# Altium schematic sheet Audio Codec.SchDoc
size Letter
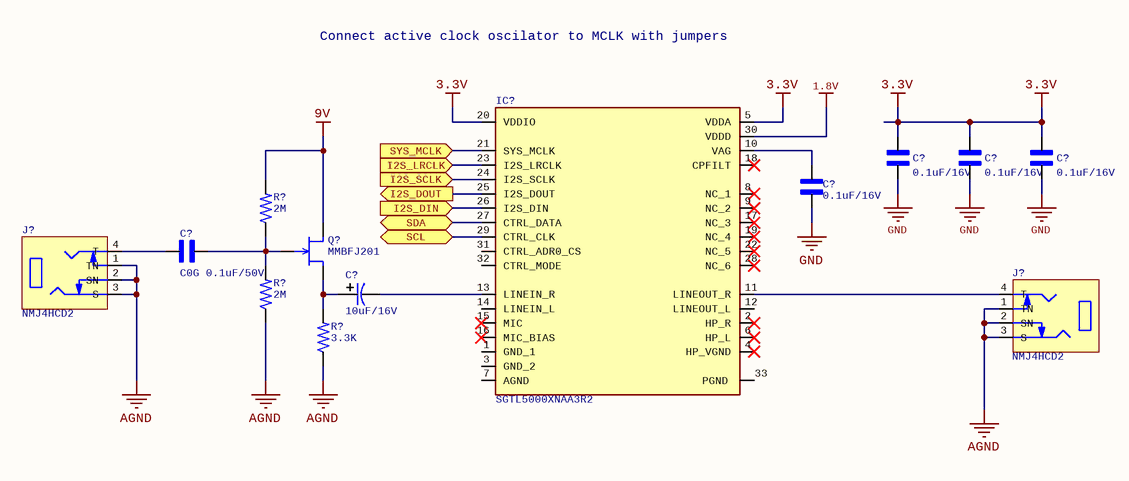
[diagram p0: Audio Codec.SchDoc]

## Parts
(Parts that share a designator on the sheet are numbered #1, #2 ... from top to bottom, then left to right.)
C?#1  0.1uF/16V  [C0603]
C?#2  0.1uF/16V  [C0603]
C?#3  0.1uF/16V  [C0603]
C?#4  0.1uF/16V  [C0603]
C?#5  C0G 0.1uF/50V  [C0603]
C?#6  10uF/16V  [C_POL_5X11_PTH]
IC?  SGTL5000XNAA3R2  [QFN32]
J?#1  NMJ4HCD2  [NMJ4HCD2]
J?#2  NMJ4HCD2  [NMJ4HCD2]
Q?  MMBFJ201  [SOT-23-3]
R?#1  2M  [R0603]
R?#2  2M  [R0603]
R?#3  3.3K  [R0603]

## Ports
I2S_DIN (in), I2S_DOUT (out), I2S_LRCLK (in), I2S_SCLK (in), SCL (bidir), SDA (bidir), SYS_MCLK (in)

## Nets
1.8V: IC?.30(VDDD)
3.3V: C?#1.1 C?#2.1 C?#3.1 IC?.5(VDDA) IC?.20(VDDIO)
9V: Q?.1(D) R?#1.2
AGND: J?#1.1(TN) J?#1.2(SN) J?#1.3(S) J?#2.1(TN) J?#2.2(SN) J?#2.3(S) R?#2.1 R?#3.1
GND: C?#1.2 C?#2.2 C?#3.2 C?#4.1
I2S_DIN: IC?.26(I2S_DIN) ; port I2S_DIN
I2S_DOUT: IC?.25(I2S_DOUT) ; port I2S_DOUT
I2S_LRCLK: IC?.23(I2S_LRCLK) ; port I2S_LRCLK
I2S_SCLK: IC?.24(I2S_SCLK) ; port I2S_SCLK
SCL: IC?.29(CTRL_CLK) ; port SCL
SDA: IC?.27(CTRL_DATA) ; port SDA
SYS_MCLK: IC?.21(SYS_MCLK) ; port SYS_MCLK
NetC?#4_2: C?#4.2 IC?.10(VAG)
NetC?#5_1: C?#5.1 J?#1.4(T)
NetC?#5_2: C?#5.2 Q?.3(G) R?#1.1 R?#2.2
NetC?#6_1: C?#6.1 Q?.2(S) R?#3.2
NetC?#6_2: C?#6.2 IC?.13(LINEIN_R)
NetIC?_11: IC?.11(LINEOUT_R) J?#2.4(T)

Not connected (* = marked no-connect by the designer): IC? 1(GND_1) 2(HP_R)* 3(GND_2) 4(HP_VGND)* 6(HP_L)* 7(AGND) 8(NC_1)* 9(NC_2)* 12(LINEOUT_L) 14(LINEIN_L) 15(MIC)* 16(MIC_BIAS)* 17(NC_3)* 18(CPFILT)* 19(NC_4)* 22(NC_5)* 28(NC_6)* 31(CTRL_ADR0_CS) 32(CTRL_MODE) 33(PGND)

## Notes on the sheet
- Connect active clock oscilator to MCLK with jumpers

## Library data of the parts
C?#1-C?#4 = C0603 0.1uF/16V: MLCC 0.1UF, 16V, X5R, 10%, 0603.; Manufacturer: Kyocera AVX; Manufacturer Part Number: 0603YD104KAT2A; Capacitance: 100nF; Supplier 1: Mouser; Supplier Part Number 1: 581-0603YD104KAT2A; RoHS: Yes; Category: Ceramic Capacitors; Stock 1: 3315; Pricing 1: 1=0.26000, 10=0.11400, 50=0.11400, 100=0.09700, 1000=0.05900, 10000=0.04800 (USD); Mount: Surface Mount; Case/Package: 0603; Number of Pins: 2; Case Code (Imperial): 0603; Case Code (Metric): 1608; Min Operating Temperature: -55°C; Max Operating Temperature: 85°C; Package Quantity: 4000; Voltage Rating: 16V; Voltage Rating (DC): 16V; Tolerance: 10%; Packaging: Tape and Reel; Dielectric: X5R; Termination: SMD/SMT; Length: 1.6mm; Width: 0.81mm; Height: 0.9mm; Thickness: 0.035inch; Depth: 0.81mm; Lead Free: Lead Free; ComponentLink1URL: https://datasheet.ciiva.com/11504/cx5r-11504040.pdf?src-supplier=Avnet; ComponentLink1Description: https://datasheet.ciiva.com/11504/cx5r-11504040.pdf?src-supplier=Avnet; ComponentLink2URL: https://datasheet.ciiva.com/208/cx5r-208121.pdf?src-supplier=Digi-Key; ComponentLink2Description: https://datasheet.ciiva.com/208/cx5r-208121.pdf?src-supplier=Digi-Key
C?#5 = C0603 0.1uF/50V: MLCC 0.1uF 50V C0G 10% 0603; Manufacturer: TDK; Manufacturer Part Number: C1608X5R1H104K080AA; Dielectric Material: Ceramic; Capacitance: 100nF; Dielectric: X5R; Supplier 1: Mouser; Supplier Part Number 1: 810-C1608X5R1H104K; RoHS: Yes; Category: Ceramic Capacitors; Stock 1: 520600; Pricing 1: 1=0.12000, 10=0.04500, 100=0.03700, 500=0.02600, 1000=0.02100, 4000=0.01800 (USD); Mount: Surface Mount; Case/Package: 0603; Number of Pins: 2; Case Code (Metric): 1608; Case Code (Imperial): 0603; Weight: 7.1E-05oz; Min Operating Temperature: -55°C; Max Operating Temperature: 85°C; Tolerance: 10%; Voltage Rating: 50V; Packaging: Tape and Reel; Voltage Rating (DC): 50V; Termination: SMD/SMT; Package Quantity: 1; Resistor Type: Ceramic; Length: 1.6mm; Width: 0.031inch; Height: 0.8mm; Depth: 0.8mm; Thickness: 0.035inch; Radiation Hardening: No; REACH SVHC: No SVHC; Lead Free: Lead Free; Supplier 2: Mouser; Supplier Part Number 2: 187-CL10B104KB8NNNC
C?#6 = CPOL 100uF/10V: Aluminum Electrolytic Capacitors - Radial Leaded 16V 10uF 5x11mm; Manufacturer: Wurth Elektronik; Manufacturer Part Number: 860010272005; Supplier 1: Mouser; Supplier Part Number 1: 710-860010272005; RoHS: Yes; Category: Capacitors; Stock 1: 5937; Pricing 1: 1=0.19000, 10=0.13600, 50=0.08200, 100=0.06900, 1000=0.04200, 10000=0.03500 (USD); Mount: Through Hole; Case/Package: Radial
IC? = SGTL5000XNAA3R2: Integrated Circuit; Manufacturer_Name: NXP; Datasheet Link: http://www.nxp.com/docs/en/data-sheet/SGTL5000.pdf; Height: 0.9mm; Manufacturer_Part_Number: SGTL5000XNAA3R2; Mouser Part Number: 841-SGTL5000XNAA3R2; Mouser Price/Stock: https://www.mouser.co.uk/ProductDetail/NXP-Semiconductors/SGTL5000XNAA3R2?qs=g5o6z0NmdpTo1sUyP1uGYA%3D%3D; Arrow Part Number: SGTL5000XNAA3R2; Arrow Price/Stock: https://www.arrow.com/en/products/sgtl5000xnaa3r2/nxp-semiconductors
J?#1 J?#2 = TS Audio Jack 6.3mm: Phone Connectors 2C MONO 2-SPST NC; Manufacturer: Neutrik; Number of Terminals/Pins: 4; Max Current Rating: 3A; Gender: Female; Voltage Rating: 50V; Number of Ports: 1; Number of Contacts: 2; Supplier 1: Mouser; Supplier Part Number 1: 550-12202; Manufacturer Part Number: NMJ4HCD2; RoHS: Yes; Category: Audio / Video Connectors; Stock 1: 39770; Pricing 1: 1=1,51000, 10=1,39000, 50=1,36000, 100=1,18000, 1000=1,11000, 10000=1,10000 (USD); Mount: Through Hole; Number of Pins: 4; Contact Plating: Silver; Color: Black; Contact Material: Brass; Weight: 0.246918oz; Housing Material: Polyamide; Min Operating Temperature: -25°C; Max Operating Temperature: 70°C; Package Quantity: 200; Termination: Through Hole; Orientation: Horizontal; Series: M; RoHS Compliant: Yes; ComponentLink1URL: https://datasheet.ciiva.com/16148/210-199761-16148179.pdf?src-supplier=Onlinecomponents.com; ComponentLink1Description: https://datasheet.ciiva.com/16148/210-199761-16148179.pdf?src-supplier=Onlinecomponents.com
Q? = JFET MMBFJ201: JFET N-Channel Transistor General Purpose; Manufacturer: ON Semiconductor / Fairchild; Power Dissipation: 350mW; Element Configuration: Single; Voltage Rating (DC): 40V; Current Rating: 50mA; Gate to Source Voltage (Vgs): -40V; Continuous Drain Current (ID): 1mA; Supplier 1: Mouser; Supplier Part Number 1: 512-MMBFJ201; Manufacturer Part Number: MMBFJ201; RoHS: Yes; Category: JFETs; Stock 1: 131519; Pricing 1: 1=0,42000, 10=0,31400, 50=0,31400, 100=0,23400, 1000=0,13200, 10000=0,12200 (USD); Case/Package: SOT-23; Number of Pins: 3; Min Operating Temperature: -55°C; Max Operating Temperature: 150°C; Packaging: Tape and Reel; Polarity: N-CHANNEL; Max Power Dissipation: 350mW; Package Quantity: 1; Length: 2.92mm; Width: 1.3mm; Height: 0.93mm; Radiation Hardening: No; REACH SVHC: No SVHC; Lead Free: Lead Free; Mount: Surface Mount; Weight: 0.03g; Drain to Source Voltage (Vdss): 40V; Series: MMBFJ201; Breakdown Voltage: -40V; RoHS Compliant: Yes
R?#1 R?#2 = R0603 1M: RES SMD 2M OHM 1% 1/10W 0603; Manufacturer: Yageo; Manufacturer Part Number: RC0603FR-071ML; Voltage Rating: 75V; Voltage Rating (DC): 50V; Resistance: 1MR; Power Rating: 100mW; Temperature Coefficient: 100ppm/°C; Application(s): HIGH RELIABILITY; Supplier 1: Mouser; Supplier Part Number 1: 603-RC0603FR-071ML; RoHS: Yes; Category: Chip SMD Resistors; Stock 1: 1321822; Pricing 1: 1=0.10000, 10=0.01800, 50=0.01800, 100=0.00700, 1000=0.00400, 10000=0.00200 (USD); Case/Package: 0603; Number of Pins: 2; Case Code (Imperial): 0603; Case Code (Metric): 1608; Weight: 0.000847oz; Min Operating Temperature: -55°C; Max Operating Temperature: 155°C; Tolerance: 1%; Packaging: Cut Tape; Package Quantity: 5000; Termination: SMD/SMT; Resistor Type: Thick Film; Type: General Purpose; Series: RC; Technology: THICK FILM; Length: 1.6mm; Width: 0.8mm; Height: 0.45mm; Depth: 0.8mm; RoHS Compliant: Yes; REACH SVHC: No SVHC; Military Standard: Not; Lead Free: Lead Free
R?#3 = R0603 3.3K: RES 0603 3.3K OHM 1% 1/10W; Manufacturer: Yageo; Manufacturer Part Number: RC0603FR-073K3L; Resistance: 3.3kR; Max Power Dissipation: 100mW; Temperature Coefficient: 100ppm/°C; Voltage Rating (DC): 50V; Supplier 1: Mouser; Supplier Part Number 1: 603-RC0603FR-073K3L; RoHS: Yes; Category: Chip SMD Resistors; Stock 1: 383635; Pricing 1: 1=0.10000, 10=0.01800, 50=0.01800, 100=0.00600, 1000=0.00500, 10000=0.00300 (USD); Case/Package: 0603; Case Code (Metric): 1608; Case Code (Imperial): 0603; Min Operating Temperature: -55°C; Max Operating Temperature: 155°C; Packaging: Tape and Reel; Resistor Type: Thick Film; Number of Terminations: 2; Tolerance: 1%; Features: Moisture Resistant; Length: 1.6mm; Width: 0.8mm; Height: 0.022inch; RoHS Compliant: Yes; Number of Pins: 2; Size Code: 0603; Power Rating: 100mW; Voltage Rating: 50V; Package Quantity: 1; Termination: SMD/SMT; Series: RC; Resistance Tolerance: 1%; Construction: Rectangular; Depth: 0.8mm; REACH SVHC: No SVHC; Lead Free: Lead Free; Military Standard: Not